# EAGLE schematic teensy_test (EAGLE 9.0.1)
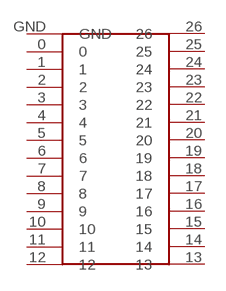
[diagram p0: schematic, sheet 1]

## Parts
U$1  TEENSY3.2  [TEENSY3.2]
Unconnected: U$1.0 U$1.1 U$1.2 U$1.3 U$1.4 U$1.5 U$1.6 U$1.7 U$1.8 U$1.9 U$1.10 U$1.11 U$1.12 U$1.13 U$1.14 U$1.15 U$1.16 U$1.17 U$1.18 U$1.19 U$1.20 U$1.21 U$1.22 U$1.23 U$1.24 U$1.25 U$1.26 U$1.GND

## Library data of the parts
U$1 = teensy_3.2:TEENSY3.2